# EAGLE design balise réceptrice - puissance et communication (EAGLE 6.3)
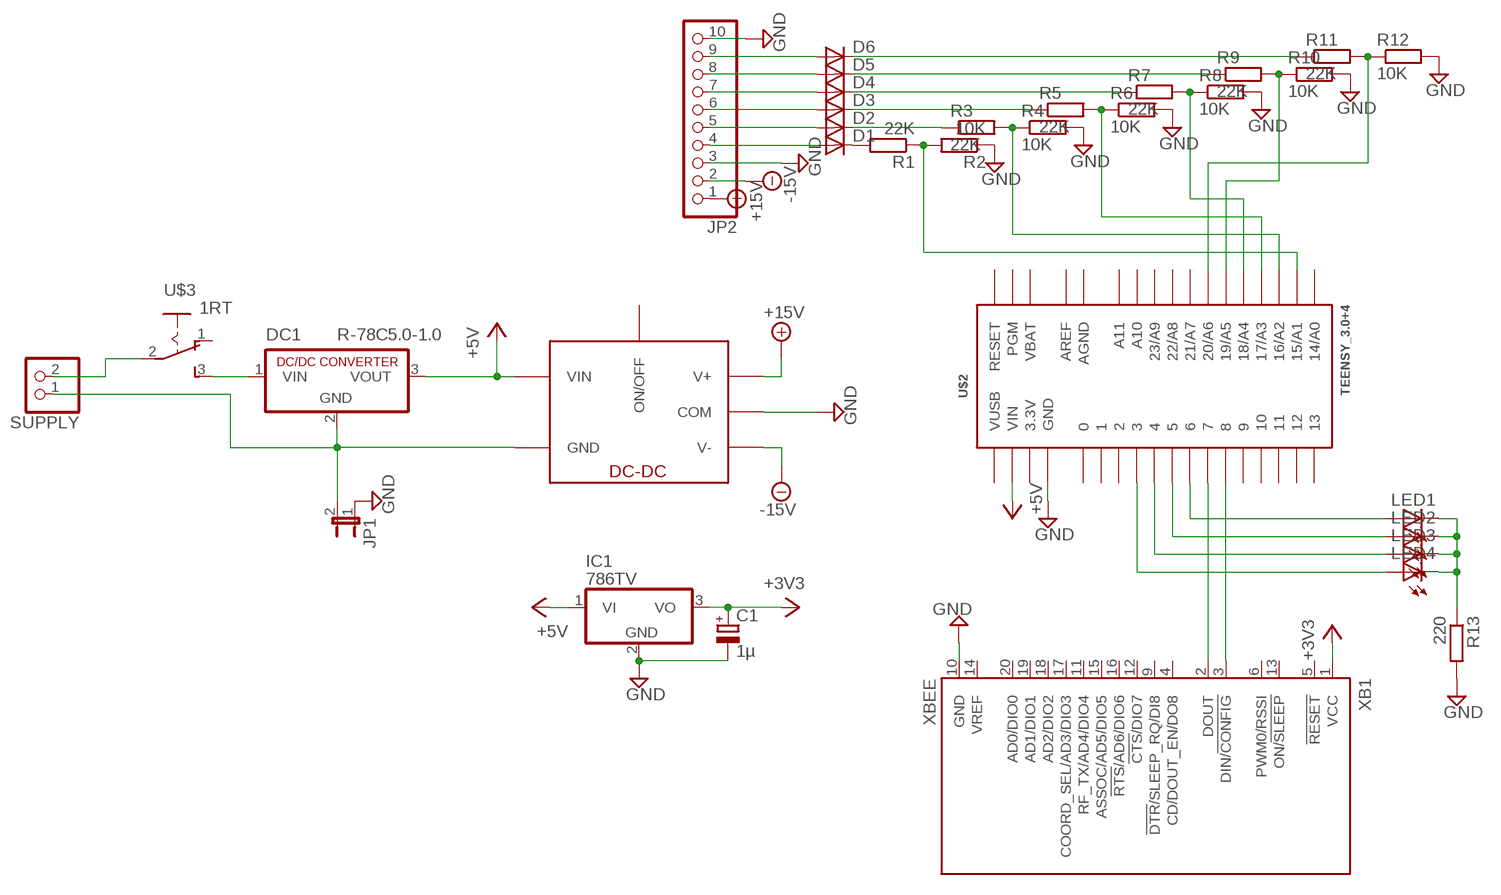
[diagram p0: schematic, sheet 1]

## Parts
C1  1µ  CPOL-EUE2,5-6E  [E2,5-6E]
D1  DIODE-D-2.5  [D-2.5]
D2  DIODE-D-2.5  [D-2.5]
D3  DIODE-D-2.5  [D-2.5]
D4  DIODE-D-2.5  [D-2.5]
D5  DIODE-D-2.5  [D-2.5]
D6  DIODE-D-2.5  [D-2.5]
DC1  R-78C5.0-1.0  [SIP3]
IC1  786TV  [TO220V]
JP1  JP1E  [JP1]
JP2  PINHD-1X10  [1X10]
LED1  LED3MM  [LED3MM]
LED2  LED3MM  [LED3MM]
LED3  LED3MM  [LED3MM]
LED4  LED3MM  [LED3MM]
R1  22K  R-EU_0204/7  [0204/7]
R2  10K  R-EU_0207/2V  [0207/2V]
R3  22K  R-EU_0204/7  [0204/7]
R4  10K  R-EU_0207/2V  [0207/2V]
R5  22K  R-EU_0204/7  [0204/7]
R6  10K  R-EU_0207/2V  [0207/2V]
R7  22K  R-EU_0204/7  [0204/7]
R8  10K  R-EU_0207/2V  [0207/2V]
R9  22K  R-EU_0204/7  [0204/7]
R10  10K  R-EU_0207/2V  [0207/2V]
R11  22K  R-EU_0204/7  [0204/7]
R12  10K  R-EU_0207/2V  [0207/2V]
R13  220  R-EU_0204/7  [0204/7]
SUPPLY  PINHD-1X2  [1X02]
U$1  TMR-6-0523  [7SIL]
U$2  TEENSY_3.0+4  [TEENSY_3.0+4]
U$3  1RT  [1RT]
XB1  XBEE  [XBEE]

## Nets
+3V3: C1.+ IC1.3(VO) XB1.1(VCC)
+5V: DC1.3(VOUT) IC1.1(VI) U$1.VCC(VIN) U$2.VIN
+15V: JP2.1 U$1.+V(V+)
-15V: JP2.2 U$1.-V(V-)
GND: C1.- IC1.2(GND) JP1.1 JP2.3 JP2.10 R2.1 R4.2 R6.2 R8.2 R10.2 R12.2 R13.2 U$1.COM U$2.GND U$2.GND1(GND) XB1.10(GND)
N$1: DC1.2(GND) JP1.2 SUPPLY.1 U$1.GND
N$2: D1.A JP2.4
N$3: U$2.7 XB1.2(DOUT)
N$4: U$2.8 XB1.3(DIN/!CONFIG)
N$5: D2.A JP2.5
N$6: D3.A JP2.6
N$7: D4.A JP2.7
N$8: D5.A JP2.8
N$9: D6.A JP2.9
N$10: R1.1 R2.2 U$2.15/A1
N$11: D1.C R1.2
N$12: D2.C R3.1
N$13: R3.2 R4.1 U$2.16/A2
N$14: D3.C R5.1
N$15: R5.2 R6.1 U$2.17/A3
N$16: D4.C R7.1
N$17: R7.2 R8.1 U$2.18/A4
N$18: D5.C R9.1
N$19: R9.2 R10.1 U$2.19/A5
N$20: D6.C R11.1
N$21: R11.2 R12.1 U$2.20/A6
N$22: DC1.1(VIN) U$3.3(S)
N$23: LED1.A U$2.6
N$24: LED2.A U$2.5
N$25: LED3.A U$2.4
N$26: LED4.A U$2.3
N$27: LED1.K(C) LED2.K(C) LED3.K(C) LED4.K(C) R13.1
N$28: SUPPLY.2 U$3.2(P)
Unconnected: U$1.ON/OFF U$2.0 U$2.1 U$2.2 U$2.9 U$2.10 U$2.11 U$2.12 U$2.13 U$2.14/A0 U$2.21/A7 U$2.22/A8 U$2.23/A9 U$2.A10 U$2.A11 U$2.PGM U$2.RESET U$3.1(O) XB1.4(CD/DOUT_EN/DO8) XB1.5(!RESET) XB1.6(PWM0/RSSI) XB1.9(!DTR!/SLEEP_RQ/DI8) XB1.11(RF_TX/AD4/DIO4) XB1.12(!CTS!/DIO7) XB1.13(ON/!SLEEP) XB1.14(VREF) XB1.15(ASSOC/AD5/DIO5) XB1.16(!RTS!/AD6/DIO6) XB1.17(COORD_SEL/AD3/DIO3) XB1.18(AD2/DIO2) XB1.19(AD1/DIO1) XB1.20(AD0/DIO0)

## Power pins joined to a net without a drawn wire
3.3V: U$2.3.3V U$2.3.3V1(3.3V)
AGND: U$2.AGND
AREF: U$2.AREF
VBAT: U$2.VBAT
VUSB: U$2.VUSB

## Library data of the parts
C1 = resistor:CPOL-EU: POLARIZED CAPACITOR, European symbol
D1-D6 = diode:DIODE-: DIODE
DC1 = dc-dc-converter:R-78C*-1.0: INNOLINE DC/DC-Converter 1.0 AMP SIP3 Single Output Source: Data sheet <http://www.mikrocontroller.net/attachment/150645/157764-da-01-en-DC_DC_WANDLER_R_78C5_0_1_0.pdf>
IC1 = linear:78*: Positive VOLTAGE REGULATOR Source: http://cache.national.com/ds/LM/LM78L05.pdf http://www.fairchildsemi.com/ds/LM/LM7805.pdf
JP1 = jumper:JP1E: JUMPER
JP2 = pinhead:PINHD-1X10: PIN HEADER
LED1-LED4 = led:LED: LED OSRAM: - CHIPLED LG R971, LG N971, LY N971, LG Q971, LY Q971, LO R971, LY R971 LH N974, LH R974 LS Q976, LO Q976, LY Q976 LO Q996 - Hyper CHIPLED LW Q18S LB Q993, LB Q99A, LB R99A - SideLED LS A670, LO A670, LY A670, LG A670, LP A670 LB A673, LV A673, LT A673, LW A673 LH A674 LY A675 LS A676, LA A676, LO A676, LY A676, LW A676 LS A679, LY A679, LG A679 - Hyper Micro SIDELED® LS Y876, LA Y876, LO Y876, LY Y876 LT Y87S - SmartLED LW L88C, LW L88S LB L89C, LB L89S, LG L890 LS L89K, LO L89K, LY L89K LS L896, LA L896, LO L896, LY L896 - TOPLED LS T670, LO T670, LY T670, LG T670, LP T670 LSG T670, LSP T670, LSY T670, LOP T670, LYG T670 LG T671, LOG T671, LSG T671 LB T673, LV T673, LT T673, LW T673 LH T674 LS T676, LA T676, LO T676, LY T676, LB T676, LH T676, LSB T676, LW T676 LB T67C, LV T67C, LT T67C, LS T67K, LO T67K, LY T67K, LW E67C LS E67B, LA E67B, LO E67B, LY E67B, LB E67C, LV E67C, LT E67C LW T67C LS T679, LY T679, LG T679 LS T770, LO T770, LY T770, LG T770, LP T770 LB T773, LV T773, LT T773, LW T773 LH T774 LS E675, LA E675, LY E675, LS T675 LS T776, LA T776, LO T776, LY T776, LB T776 LHGB T686 LT T68C, LB T68C - Hyper Mini TOPLED® LB M676 - Mini TOPLED Santana® LG M470 LS M47K, LO M47K, LY M47K Source: http://www.osram.convergy.de LUXEON: - LUMILED® LXK2-PW12-R00, LXK2-PW12-S00, LXK2-PW14-U00, LXK2-PW14-V00 LXK2-PM12-R00, LXK2-PM12-S00, LXK2-PM14-U00 LXK2-PE12-Q00, LXK2-PE12-R00, LXK2-PE12-S00, LXK2-PE14-T00, LXK2-PE14-U00 LXK2-PB12-K00, LXK2-PB12-L00, LXK2-PB12-M00, LXK2-PB14-N00, LXK2-PB14-P00, LXK2-PB14-Q00 LXK2-PR12-L00, LXK2-PR12-M00, LXK2-PR14-Q00, LXK2-PR14-R00 LXK2-PD12-Q00, LXK2-PD12-R00, LXK2-PD12-S00 LXK2-PH12-R00, LXK2-PH12-S00 LXK2-PL12-P00, LXK2-PL12-Q00, LXK2-PL12-R00 Source: www.luxeon.com KINGBRIGHT: KA-3528ASYC Source: www.kingbright.com
R1-R13 = resistor:R-EU_: RESISTOR, European symbol
SUPPLY = pinhead:PINHD-1X2: PIN HEADER
U$1 = dc-dc-converter:TMR-6-0523
U$2 = Teensy3.0:TEENSY_3.0+4: Teensy 3.0 board, showing all pins that are easily acessible. See 'AllAnalogPins" and 'AllPins' packages for additional pin holes, as needed. The 'Basic' package has fewer pins.
U$3 = switch:1RT
XB1 = maxstream:XBEE: XBee (TM) /XBee-PRO(TM) OEM RF Modules Source: MaxStream, Inc. xbee_productmanual.pdf; MPN: XBP24-Z7UIT-004; OC_FARNELL: 1751799; OC_NEWARK: 34R5507

## Board
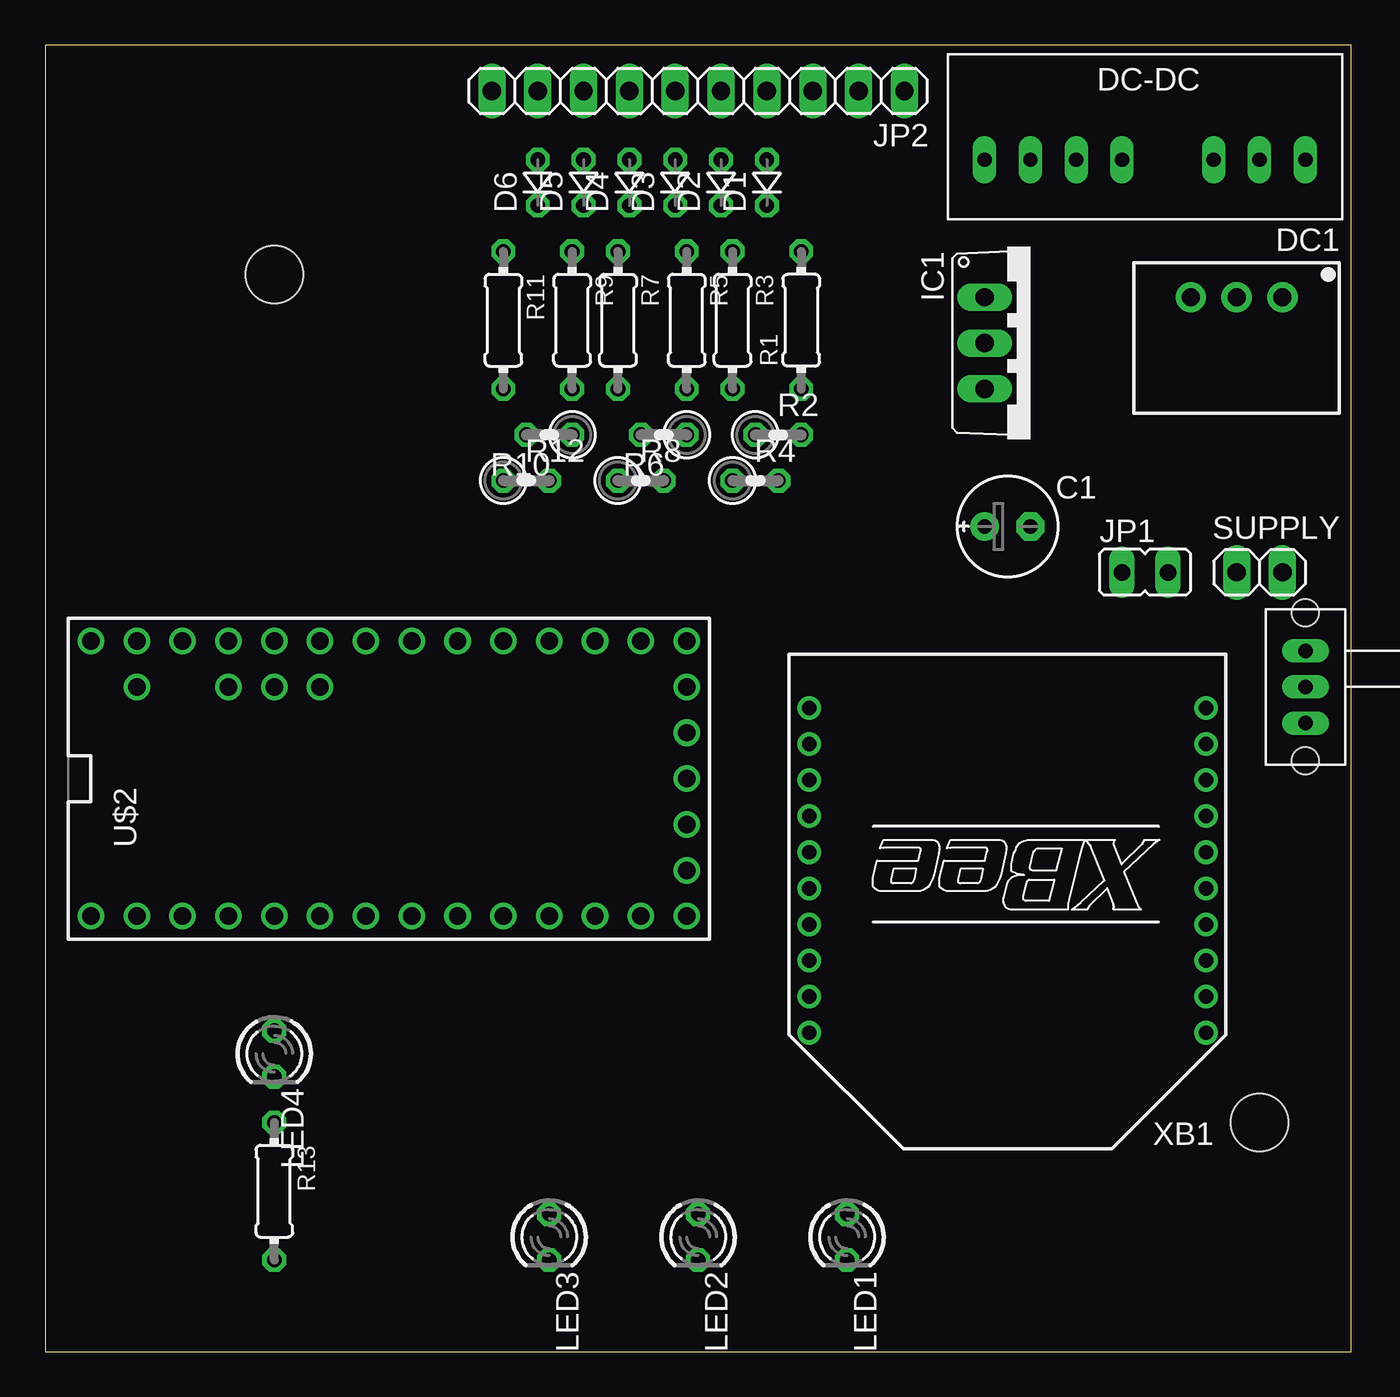
[diagram p1: board, top side]
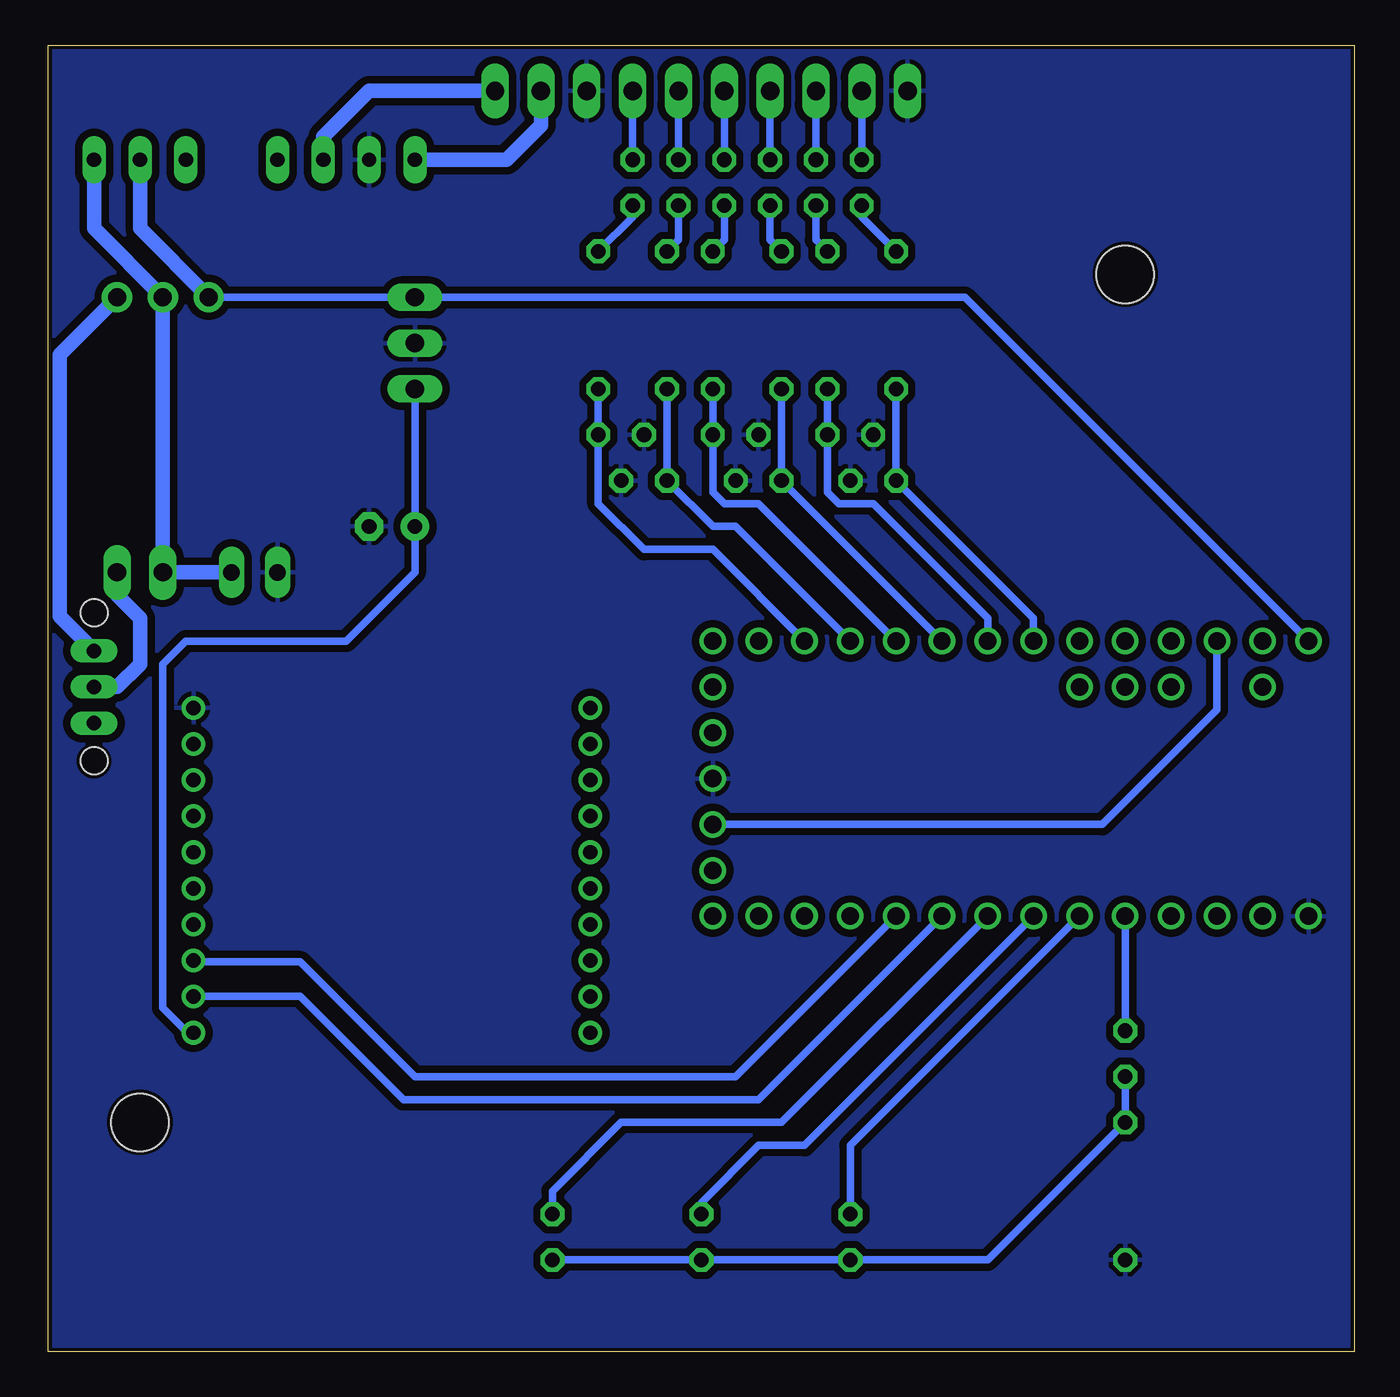
[diagram p2: board, bottom side, seen from below]

Size 72.39 x 72.39 mm. Coordinates in mm from the lower left corner, seen from the top.
Outline: 72.39,0 72.39,72.39 0,72.39 0,0 72.39,0
Copper layers (1*16): Top 0.035mm / dielectric 1.5mm / Bottom 0.035mm
Design rules "dipole-électronique.fr": minimum track width 10mil, minimum drill 24mil, track to track 16mil, track to pad 16mil, pad to pad 16mil, via to via 16mil, smd to smd 16mil, copper to edge 8mil, drill to drill 8mil, minimum pad ring 10mil, minimum via ring 8mil, stop-mask expansion 4mil, vias tented up to drill 0mil, thermal gap 10mil
Holes 3.2 mm at 12.7,59.69 67.31,12.7

### Footprints (pad centres in the part's own frame; a part is rotated, then mirrored left to right if it is on the bottom)
E2,5-6E = drill 0.813 pad 1.575: + -1.27,0 | drill 0.813 pad 1.575 octagon: - 1.27,0
D-2.5 = drill 0.813 octagon: A 1.27,0; C -1.27,0
SIP3 = drill 1 pad 1.676: 1 -2.54,0; 2 0,0; 3 2.54,0
TO220V = drill 1.016 long: 1 -2.54,-2.54; 2 0,-2.54; 3 2.54,-2.54
JP1 = drill 0.914 long: 1 0,-1.27; 2 0,1.27
1X10 = drill 1.016 long: 1 -11.43,0; 2 -8.89,0; 3 -6.35,0; 4 -3.81,0; 5 -1.27,0; 6 1.27,0; 7 3.81,0; 8 6.35,0; 9 8.89,0; 10 11.43,0
LED3MM = drill 0.813 octagon: A -1.27,0; K 1.27,0
0204/7 = drill 0.813 octagon: 1 -3.81,0; 2 3.81,0
0207/2V = drill 0.813 octagon: 1 -1.27,0; 2 1.27,0
1X02 = drill 1.016 long: 1 -1.27,0; 2 1.27,0
7SIL = drill 0.8 long: +V 5.08,0; -V 10.16,0; COM 7.62,0; GND -7.62,0; NC 2.54,0; ON/OFF -2.54,0; VCC -5.08,0
TEENSY_3.0+4 = drill 0.965: 0 -7.62,13.97; 1 -7.62,11.43; 2 -7.62,8.89; 3 -7.62,6.35; 3.3V 7.62,11.43; 3.3V1 -2.54,-16.51; 4 -7.62,3.81; 5 -7.62,1.27; 6 -7.62,-1.27; 7 -7.62,-3.81; 8 -7.62,-6.35; 9 -7.62,-8.89; 10 -7.62,-11.43; 11 -7.62,-13.97; 12 -7.62,-16.51; 13 7.62,-16.51; 14/A0 7.62,-13.97; 15/A1 7.62,-11.43; 16/A2 7.62,-8.89; 17/A3 7.62,-6.35; 18/A4 7.62,-3.81; 19/A5 7.62,-1.27; 20/A6 7.62,1.27; 21/A7 7.62,3.81; 22/A8 7.62,6.35; 23/A9 7.62,8.89; A10 5.08,6.35; A11 5.08,3.81; AGND 7.62,13.97; AREF 5.08,8.89; GND -7.62,16.51; GND1 0,-16.51; PGM 2.54,-16.51; RESET 5.08,-16.51; VBAT -5.08,-16.51; VIN 7.62,16.51; VUSB 5.08,13.97
1RT = drill 0.8 long: 1 -2,0; 2 0,0; 3 2,0 | hole 1.5: 4.1,0; -4.1,0
XBEE = drill 0.8 pad 1.27: 1 -11,9; 2 -11,7; 3 -11,5; 4 -11,3; 5 -11,1; 6 -11,-1; 7 -11,-3; 8 -11,-5; 9 -11,-7; 10 -11,-9; 11 11,-9; 12 11,-7; 13 11,-5; 14 11,-3; 15 11,-1; 16 11,1; 17 11,3; 18 11,5; 19 11,7; 20 11,9

### Placement (x,y rotation side)
C1  53.34,45.72 0 top
D1  40.01,64.77 90 top
D2  37.47,64.77 90 top
D3  34.92,64.77 90 top
D4  32.38,64.77 90 top
D5  29.84,64.77 90 top
D6  27.3,64.77 90 top
DC1  66.04,58.42 180 top
IC1  54.61,55.88 270 top
JP1  60.96,43.18 270 top
JP2  36.2,69.85 180 top
LED1  44.45,6.35 270 top
LED2  36.2,6.35 270 top
LED3  27.94,6.35 270 top
LED4  12.7,16.51 270 top
R1  41.91,57.15 90 top
R2  40.64,50.8 0 top
R3  38.1,57.15 270 top
R4  39.37,48.26 0 top
R5  35.56,57.15 270 top
R6  34.29,50.8 180 top
R7  31.75,57.15 270 top
R8  33.02,48.26 0 top
R9  29.21,57.15 270 top
R10  27.94,50.8 180 top
R11  25.4,57.15 270 top
R12  26.67,48.26 0 top
R13  12.7,8.89 270 top
SUPPLY  67.31,43.18 0 top
U$1  62.23,66.04 180 top
U$2  19.05,31.75 90 top
U$3  69.85,36.83 90 top
XB1  53.34,26.67 180 top

### Tracks (layer width: path | path; a pad name or v marks a point on that pad's centre or on a via)
3.3V
  Bottom 0.406: U$2.3.3V 7.62,35.56 13.97,29.21 U$2.3.3V1
+3V3
  Bottom 0.406: IC1.3 C1.+ 52.07,43.18 55.88,39.37 64.77,39.37 66.04,38.1 66.04,19.05 64.77,17.78 64.45,17.78 XB1.1
+5V
  Bottom 0.406: U$2.VIN 21.59,58.42 IC1.1 DC1.3
  Bottom 0.813: DC1.3 67.31,62.23 U$1.VCC
+15V
  Bottom 0.813: U$1.+V 57.15,67.31 54.61,69.85 JP2.1
-15V
  Bottom 0.813: U$1.-V 46.99,66.04 45.09,67.94 JP2.2
GND
  pour Bottom: 0,72.39 0,0 72.39,0 72.39,72.39
N$1
  Bottom 0.813: U$1.GND 69.85,62.23 DC1.2 SUPPLY.1 JP1.2
N$2
  Bottom 0.406: JP2.4 D1.A
N$3
  Bottom 0.406: U$2.7 33.02,13.97 52.7,13.97 58.42,19.68 64.33,19.68 XB1.2
N$4
  Bottom 0.406: U$2.8 34.29,15.24 52.07,15.24 58.42,21.59 64.26,21.59 XB1.3
N$5
  Bottom 0.406: JP2.5 D2.A
N$6
  Bottom 0.406: JP2.6 D3.A
N$7
  Bottom 0.406: JP2.7 D4.A
N$8
  Bottom 0.406: JP2.8 D5.A
N$9
  Bottom 0.406: JP2.9 D6.A
N$10
  Bottom 0.406: R1.1 R2.2 41.91,46.99 39.37,44.45 35.56,44.45 U$2.15/A1
N$11
  Bottom 0.406: D1.C 40.01,62.87 R1.2
N$12
  Bottom 0.406: D2.C 37.47,61.59 R3.1
N$13
  Bottom 0.406: R3.2 R4.1 35.56,45.72 34.29,45.72 U$2.16/A2
N$14
  Bottom 0.406: D3.C 34.92,61.59 R5.1
N$15
  Bottom 0.406: R5.2 R6.1 35.56,47.62 34.92,46.99 33.02,46.99 U$2.17/A3
N$16
  Bottom 0.406: D4.C 32.38,61.59 R7.1
N$17
  Bottom 0.406: R7.2 R8.1 U$2.18/A4
N$18
  Bottom 0.406: D5.C 29.84,61.59 R9.1
N$19
  Bottom 0.406: R9.2 R10.1 29.21,47.62 28.57,46.99 26.67,46.99 20.32,40.64 U$2.19/A5
N$20
  Bottom 0.406: D6.C 27.3,62.87 R11.1
N$21
  Bottom 0.406: R11.2 R12.1 17.78,40.64 U$2.20/A6
N$22
  Bottom 0.813: DC1.1 71.75,55.24 71.75,40.73 U$3.3
N$23
  Bottom 0.406: U$2.6 31.75,12.7 40.64,12.7 44.45,8.89 LED1.A
N$24
  Bottom 0.406: U$2.5 30.48,11.43 33.02,11.43 36.2,8.26 LED2.A
N$25
  Bottom 0.406: U$2.4 27.94,11.43 LED3.A
N$26
  Bottom 0.406: U$2.3 LED4.A
N$27
  Bottom 0.406: LED4.K R13.1 20.32,5.08 LED3.K LED2.K LED1.K
N$28
  Bottom 0.813: SUPPLY.2 68.58,41.91 67.31,40.64 67.31,38.1 68.58,36.83 U$3.2